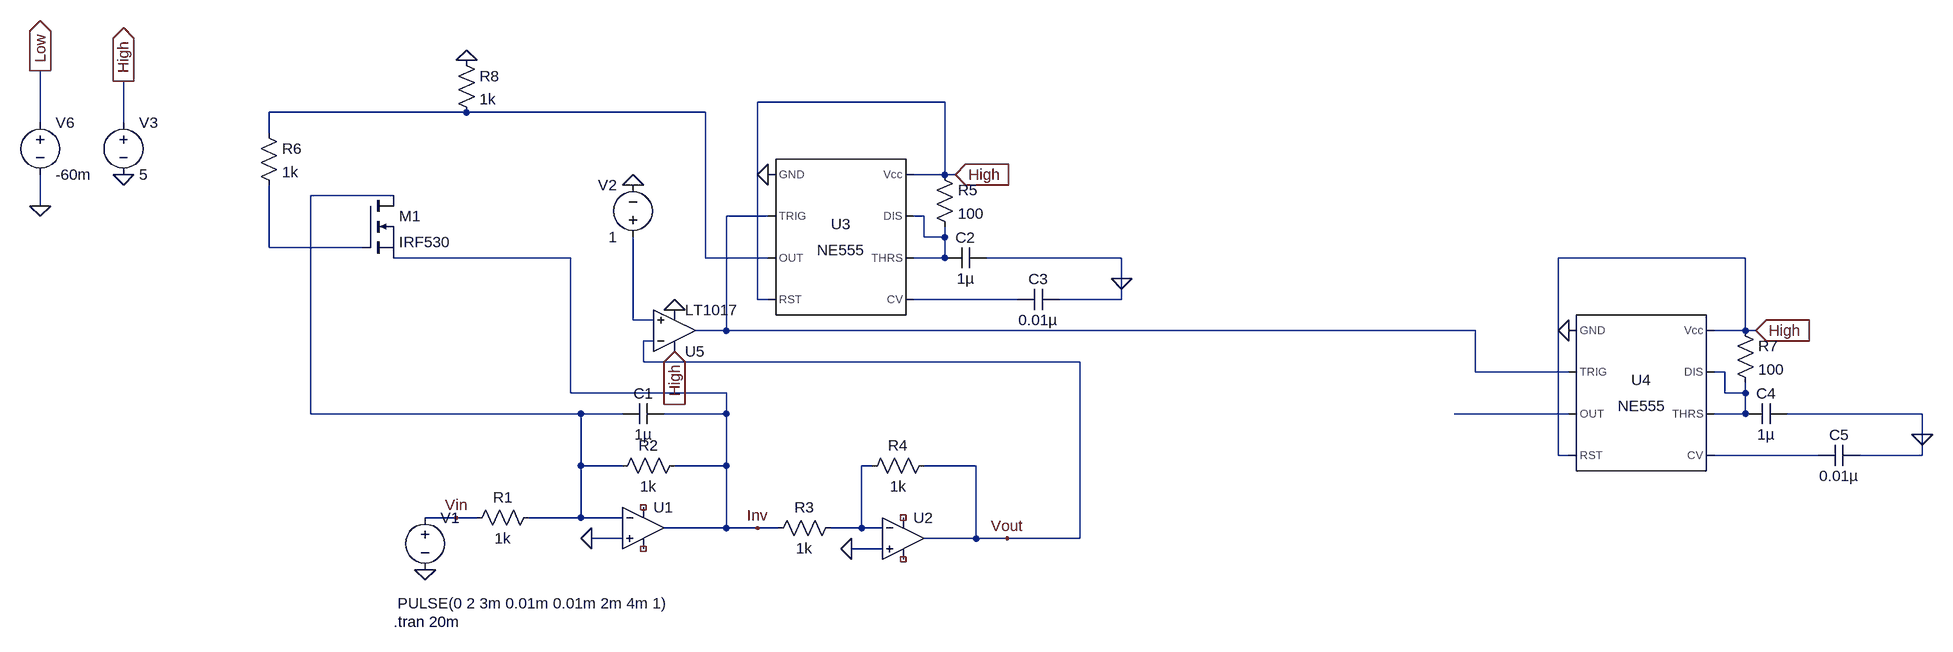
[diagram p0: schematic draftfin.asc]
draftfin.asc, the LTspice schematic file:
Version 4
SHEET 1 3484 680
WIRE 720 -512 432 -512
WIRE -16 -496 -320 -496
WIRE 352 -496 -16 -496
WIRE -672 -480 -672 -560
WIRE -544 -480 -544 -544
WIRE -320 -464 -320 -496
WIRE 720 -400 720 -512
WIRE 720 -400 672 -400
WIRE 736 -400 720 -400
WIRE -128 -368 -256 -368
WIRE -672 -352 -672 -400
WIRE 448 -336 384 -336
WIRE 688 -336 672 -336
WIRE 688 -304 688 -336
WIRE 720 -304 720 -320
WIRE 720 -304 688 -304
WIRE -320 -288 -320 -384
WIRE -176 -288 -320 -288
WIRE 144 -272 -128 -272
WIRE 352 -272 352 -496
WIRE 448 -272 352 -272
WIRE 720 -272 720 -304
WIRE 720 -272 672 -272
WIRE 992 -272 784 -272
WIRE 1952 -272 1664 -272
WIRE 992 -240 992 -272
WIRE 432 -208 432 -512
WIRE 448 -208 432 -208
WIRE 832 -208 672 -208
WIRE 992 -208 992 -240
WIRE 992 -208 896 -208
WIRE 240 -176 240 -304
WIRE 272 -176 240 -176
WIRE 384 -160 384 -336
WIRE 384 -160 336 -160
WIRE 1536 -160 384 -160
WIRE 1952 -160 1952 -272
WIRE 1952 -160 1904 -160
WIRE 1968 -160 1952 -160
WIRE 272 -144 256 -144
WIRE 256 -112 256 -144
WIRE 928 -112 256 -112
WIRE 1536 -96 1536 -160
WIRE 1680 -96 1536 -96
WIRE 1920 -96 1904 -96
WIRE 144 -64 144 -272
WIRE 384 -64 144 -64
WIRE 1920 -64 1920 -96
WIRE 1952 -64 1952 -80
WIRE 1952 -64 1920 -64
WIRE -256 -32 -256 -368
WIRE 160 -32 -256 -32
WIRE 224 -32 160 -32
WIRE 384 -32 384 -64
WIRE 384 -32 288 -32
WIRE 1680 -32 1504 -32
WIRE 1952 -32 1952 -64
WIRE 1952 -32 1904 -32
WIRE 2224 -32 2016 -32
WIRE 2224 0 2224 -32
WIRE 1664 32 1664 -272
WIRE 1680 32 1664 32
WIRE 2064 32 1904 32
WIRE 2224 32 2224 0
WIRE 2224 32 2128 32
WIRE 160 48 160 -32
WIRE 224 48 160 48
WIRE 384 48 384 -32
WIRE 384 48 304 48
WIRE 608 48 592 48
WIRE 768 48 688 48
WIRE -32 128 -80 128
WIRE 0 128 -32 128
WIRE 160 128 160 48
WIRE 160 128 80 128
WIRE 224 128 160 128
WIRE 384 144 384 48
WIRE 384 144 288 144
WIRE 432 144 384 144
WIRE 464 144 432 144
WIRE 592 144 592 48
WIRE 592 144 544 144
WIRE 624 144 592 144
WIRE 224 160 176 160
WIRE 768 160 768 48
WIRE 768 160 688 160
WIRE 816 160 768 160
WIRE 928 160 928 -112
WIRE 928 160 816 160
WIRE 624 176 576 176
FLAG -80 208 0
FLAG 176 160 0
FLAG 576 176 0
FLAG -32 128 Vin
FLAG 432 144 Inv
FLAG 816 160 Vout
FLAG 240 -384 0
FLAG -544 -400 0
FLAG -544 -544 High
IOPIN -544 -544 Out
FLAG 304 -128 High
IOPIN 304 -128 In
FLAG 304 -192 0
FLAG 736 -400 High
IOPIN 736 -400 In
FLAG 992 -240 0
FLAG 448 -400 0
FLAG -672 -352 0
FLAG -672 -560 Low
IOPIN -672 -560 Out
FLAG -16 -576 0
FLAG 1968 -160 High
IOPIN 1968 -160 In
FLAG 2224 0 0
FLAG 1680 -160 0
SYMBOL OpAmps\\UniversalOpAmp 256 144 R0
SYMATTR InstName U1
SYMBOL res 96 112 R90
WINDOW 0 0 56 VBottom 2
WINDOW 3 32 56 VTop 2
SYMATTR InstName R1
SYMATTR Value 1k
SYMBOL res 320 32 R90
WINDOW 0 0 56 VBottom 2
WINDOW 3 32 56 VTop 2
SYMATTR InstName R2
SYMATTR Value 1k
SYMBOL cap 288 -48 R90
WINDOW 0 0 32 VBottom 2
WINDOW 3 32 32 VTop 2
SYMATTR InstName C1
SYMATTR Value 1µ
SYMBOL voltage -80 112 R0
WINDOW 3 -42 148 Left 2
WINDOW 123 0 0 Left 0
WINDOW 39 0 0 Left 0
SYMATTR Value PULSE(0 2 3m 0.01m 0.01m 2m 4m 1)
SYMATTR InstName V1
SYMBOL res 560 128 R90
WINDOW 0 0 56 VBottom 2
WINDOW 3 32 56 VTop 2
SYMATTR InstName R3
SYMATTR Value 1k
SYMBOL OpAmps\\UniversalOpAmp 656 160 R0
SYMATTR InstName U2
SYMBOL res 704 32 R90
WINDOW 0 0 56 VBottom 2
WINDOW 3 32 56 VTop 2
SYMATTR InstName R4
SYMATTR Value 1k
SYMBOL Misc\\NE555 560 -304 R0
SYMATTR InstName U3
SYMBOL voltage 240 -288 R180
WINDOW 0 24 96 Left 2
WINDOW 3 24 16 Left 2
WINDOW 123 0 0 Left 0
WINDOW 39 0 0 Left 0
SYMATTR InstName V2
SYMATTR Value 1
SYMBOL voltage -544 -496 R0
WINDOW 123 0 0 Left 0
WINDOW 39 0 0 Left 0
SYMATTR InstName V3
SYMATTR Value 5
SYMBOL Comparators\\LT1017 304 -160 M180
SYMATTR InstName U5
SYMBOL res 704 -416 R0
SYMATTR InstName R5
SYMATTR Value 100
SYMBOL cap 784 -288 R90
WINDOW 0 0 32 VBottom 2
WINDOW 3 32 32 VTop 2
SYMATTR InstName C2
SYMATTR Value 1µ
SYMBOL cap 896 -224 R90
WINDOW 0 0 32 VBottom 2
WINDOW 3 32 32 VTop 2
SYMATTR InstName C3
SYMATTR Value 0.01µ
SYMBOL nmos -176 -368 R0
SYMATTR InstName M1
SYMATTR Value IRF530
SYMBOL voltage -672 -496 R0
WINDOW 123 0 0 Left 0
WINDOW 39 0 0 Left 0
SYMATTR InstName V6
SYMATTR Value -60m
SYMBOL res -336 -480 R0
SYMATTR InstName R6
SYMATTR Value 1k
SYMBOL res -32 -592 R0
SYMATTR InstName R8
SYMATTR Value 1k
SYMBOL Misc\\NE555 1792 -64 R0
SYMATTR InstName U4
SYMBOL res 1936 -176 R0
SYMATTR InstName R7
SYMATTR Value 100
SYMBOL cap 2016 -48 R90
WINDOW 0 0 32 VBottom 2
WINDOW 3 32 32 VTop 2
SYMATTR InstName C4
SYMATTR Value 1µ
SYMBOL cap 2128 16 R90
WINDOW 0 0 32 VBottom 2
WINDOW 3 32 32 VTop 2
SYMATTR InstName C5
SYMATTR Value 0.01µ
TEXT -128 288 Left 2 !.tran 20m

The netlist it stands for:
* draftfin.asc
XU1 0 N002 NC_01 NC_02 Inv level1 Avol=1Meg GBW=10Meg Vos=0 En=0 Enk=0 In=0 Ink=0 Rin=500Meg  ; pins In+ In- V+ V- OUT
R1 N002 Vin 1k
R2 Inv N002 1k
C1 Inv N002 1µ
V1 Vin 0 PULSE(0 2 3m 0.01m 0.01m 2m 4m 1)
R3 N011 Inv 1k
XU2 0 N011 NC_03 NC_04 Vout level1 Avol=1Meg GBW=10Meg Vos=0 En=0 Enk=0 In=0 Ink=0 Rin=500Meg  ; pins In+ In- V+ V- OUT
R4 Vout N011 1k
XU3 0 N003 N001 High N006 N004 N004 High NE555  ; pins GND TRIG OUT RST CV THRS DIS Vcc
V2 N007 0 1
V3 High 0 5
XU5 N007 Vout High 0 N003 LT1017  ; pins In+ In- V+ V- OUT
R5 High N004 100
C2 0 N004 1µ
C3 0 N006 0.01µ
M1 N002 N005 Inv Inv IRF530
V6 Low 0 -60m
R6 N001 N005 1k
R8 0 N001 1k
XU4 0 N003 N009 High N010 N008 N008 High NE555  ; pins GND TRIG OUT RST CV THRS DIS Vcc
R7 High N008 100
C4 0 N008 1µ
C5 0 N010 0.01µ
.model NMOS NMOS
.model PMOS PMOS
.lib standard.mos
.tran 20m
.lib UniversalOpAmp1.lib
.lib NE555.sub
.backanno
.end